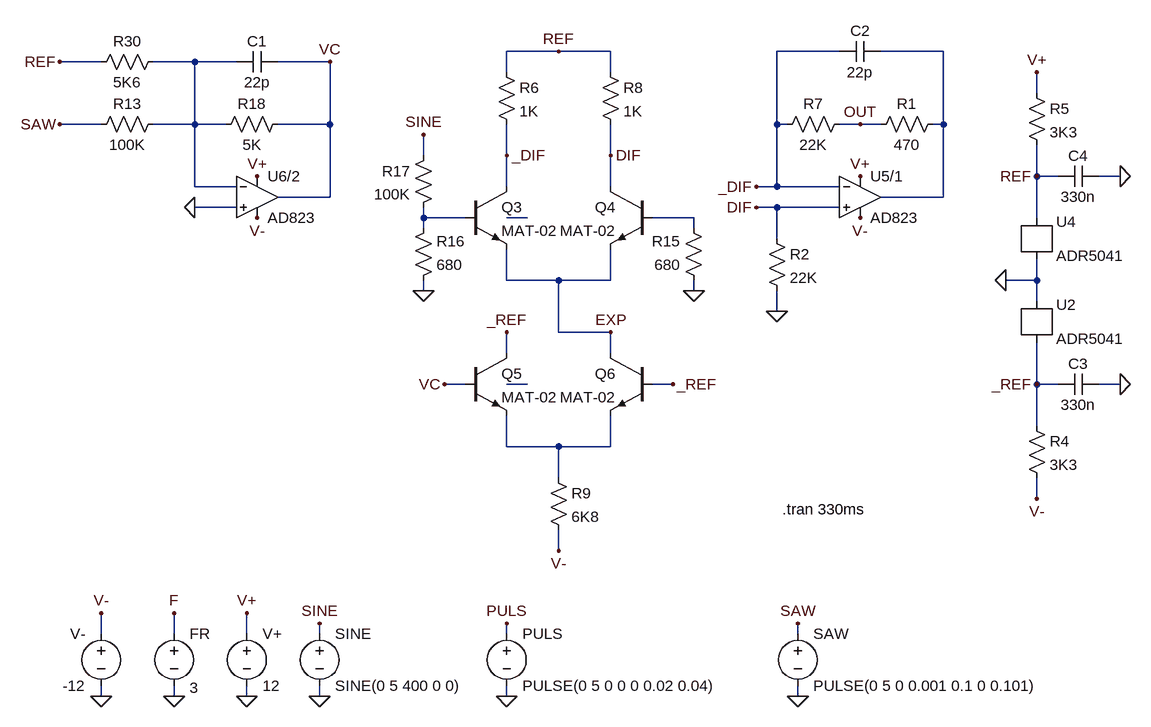
[diagram p0: schematic VCA.asc]
VCA.asc, the LTspice schematic file:
Version 4
SHEET 1 3068 3424
WIRE 1488 -240 1408 -240
WIRE 1568 -240 1488 -240
WIRE 1920 -240 1824 -240
WIRE 2080 -240 1984 -240
WIRE 784 -224 720 -224
WIRE 928 -224 864 -224
WIRE 992 -224 928 -224
WIRE 1136 -224 1056 -224
WIRE 1408 -208 1408 -240
WIRE 1568 -208 1568 -240
WIRE 2224 -176 2224 -208
WIRE 784 -128 720 -128
WIRE 928 -128 928 -224
WIRE 928 -128 864 -128
WIRE 976 -128 928 -128
WIRE 1136 -128 1136 -224
WIRE 1136 -128 1056 -128
WIRE 1824 -128 1824 -240
WIRE 1840 -128 1824 -128
WIRE 1952 -128 1920 -128
WIRE 1984 -128 1952 -128
WIRE 2080 -128 2080 -240
WIRE 2080 -128 2064 -128
WIRE 1280 -80 1280 -112
WIRE 1408 -80 1408 -128
WIRE 1568 -80 1568 -128
WIRE 2224 -48 2224 -96
WIRE 2256 -48 2224 -48
WIRE 2352 -48 2320 -48
WIRE 928 -32 928 -128
WIRE 992 -32 928 -32
WIRE 1408 -32 1408 -80
WIRE 1568 -32 1568 -80
WIRE 1824 -32 1824 -128
WIRE 1824 -32 1792 -32
WIRE 1920 -32 1824 -32
WIRE 1136 -16 1136 -128
WIRE 1136 -16 1056 -16
WIRE 2080 -16 2080 -128
WIRE 2080 -16 1984 -16
WIRE 992 0 928 0
WIRE 1824 0 1792 0
WIRE 1920 0 1824 0
WIRE 1280 16 1280 0
WIRE 1344 16 1280 16
WIRE 1440 16 1408 16
WIRE 1696 16 1632 16
WIRE 2224 16 2224 -48
WIRE 1280 32 1280 16
WIRE 1696 32 1696 16
WIRE 1824 48 1824 0
WIRE 1408 112 1408 64
WIRE 1488 112 1408 112
WIRE 1568 112 1568 64
WIRE 1568 112 1488 112
WIRE 2224 112 2224 80
WIRE 2224 112 2176 112
WIRE 1280 128 1280 112
WIRE 1696 128 1696 112
WIRE 2224 144 2224 112
WIRE 1824 160 1824 128
WIRE 1488 192 1488 112
WIRE 1568 192 1488 192
WIRE 1408 224 1408 192
WIRE 1568 224 1568 192
WIRE 1344 272 1312 272
WIRE 1440 272 1408 272
WIRE 1664 272 1632 272
WIRE 2224 272 2224 208
WIRE 2256 272 2224 272
WIRE 2352 272 2320 272
WIRE 2224 336 2224 272
WIRE 1408 368 1408 320
WIRE 1488 368 1408 368
WIRE 1568 368 1568 320
WIRE 1568 368 1488 368
WIRE 1488 416 1488 368
WIRE 2224 448 2224 416
WIRE 1488 528 1488 496
WIRE 784 656 784 624
WIRE 896 656 896 624
WIRE 1008 656 1008 624
WIRE 1120 656 1120 640
WIRE 1408 656 1408 640
WIRE 1856 656 1856 640
WIRE 784 752 784 736
WIRE 896 752 896 736
WIRE 1008 752 1008 736
WIRE 1120 752 1120 736
WIRE 1408 752 1408 736
WIRE 1856 752 1856 736
FLAG 1008 624 V+
FLAG 784 624 V-
FLAG 1952 -48 V+
FLAG 1952 16 V-
FLAG 1856 640 SAW
FLAG 1952 -128 OUT
FLAG 896 624 F
FLAG 896 752 0
FLAG 1856 752 0
FLAG 1008 752 0
FLAG 784 752 0
FLAG 1024 -48 V+
FLAG 1024 16 V-
FLAG 720 -224 REF
FLAG 1408 752 0
FLAG 1408 640 PULS
FLAG 1120 752 0
FLAG 1120 640 SINE
FLAG 1408 -80 _DIF
FLAG 1792 0 DIF
FLAG 1792 -32 _DIF
FLAG 1568 -80 DIF
FLAG 2176 112 0
FLAG 2224 -208 V+
FLAG 2224 448 V-
FLAG 2224 272 _REF
FLAG 2224 -48 REF
FLAG 1488 -240 REF
FLAG 1696 128 0
FLAG 1280 128 0
FLAG 1280 -112 SINE
FLAG 2352 272 0
FLAG 2352 -48 0
FLAG 1408 192 _REF
FLAG 1568 192 EXP
FLAG 1664 272 _REF
FLAG 1312 272 VC
FLAG 1136 -224 VC
FLAG 1488 528 V-
FLAG 720 -128 SAW
FLAG 1824 160 0
FLAG 928 0 0
SYMBOL voltage 1008 640 R0
SYMATTR InstName V+
SYMATTR Value 12
SYMBOL voltage 1856 640 R0
SYMATTR InstName SAW
SYMATTR Value PULSE(0 5 0 0.001 0.1 0 0.101)
SYMBOL voltage 784 640 M0
SYMATTR InstName V-
SYMATTR Value -12
SYMBOL OpAmps/AD823 1952 -80 R0
SYMATTR InstName U5/1
SYMBOL voltage 896 640 R0
WINDOW 3 24 99 Left 2
SYMATTR Value 3
SYMATTR InstName FR
SYMBOL OpAmps/AD823 1024 -80 R0
SYMATTR InstName U6/2
SYMBOL Res 1072 -144 R90
WINDOW 0 0 56 VBottom 2
WINDOW 3 32 56 VTop 2
SYMATTR InstName R18
SYMATTR Value 5K
SYMBOL Cap 1056 -240 R90
WINDOW 0 0 32 VBottom 2
WINDOW 3 32 32 VTop 2
SYMATTR InstName C1
SYMATTR Value 22p
SYMBOL Res 880 -240 R90
WINDOW 0 0 56 VBottom 2
WINDOW 3 32 56 VTop 2
SYMATTR InstName R30
SYMATTR Value 5K6
SYMBOL voltage 1408 640 R0
SYMATTR InstName PULS
SYMATTR Value PULSE(0 5 0 0 0 0.02 0.04)
SYMBOL voltage 1120 640 R0
SYMATTR InstName SINE
SYMATTR Value SINE(0 5 400 0 0)
SYMBOL npn 1344 -32 R0
SYMATTR InstName Q3
SYMATTR Value MAT-02
SYMBOL npn 1632 -32 M0
SYMATTR InstName Q4
SYMATTR Value MAT-02
SYMBOL References/ADR5041 2224 48 R0
SYMATTR InstName U4
SYMBOL Res 1936 -144 R90
WINDOW 0 0 56 VBottom 2
WINDOW 3 32 56 VTop 2
SYMATTR InstName R7
SYMATTR Value 22K
SYMBOL References/ADR5041 2224 176 R0
SYMATTR InstName U2
SYMBOL Res 2208 320 R0
SYMATTR InstName R4
SYMATTR Value 3K3
SYMBOL Res 2208 -192 R0
SYMATTR InstName R5
SYMATTR Value 3K3
SYMBOL Res 1392 -224 R0
SYMATTR InstName R6
SYMATTR Value 1K
SYMBOL Res 1552 -224 R0
SYMATTR InstName R8
SYMATTR Value 1K
SYMBOL Res 1712 128 R180
WINDOW 0 36 76 Left 2
WINDOW 3 36 40 Left 2
SYMATTR InstName R15
SYMATTR Value 680
SYMBOL Res 1264 128 M180
WINDOW 0 36 76 Left 2
WINDOW 3 36 40 Left 2
SYMATTR InstName R16
SYMATTR Value 680
SYMBOL Res 1296 -96 M0
SYMATTR InstName R17
SYMATTR Value 100K
SYMBOL Cap 1984 -256 R90
WINDOW 0 0 32 VBottom 2
WINDOW 3 32 32 VTop 2
SYMATTR InstName C2
SYMATTR Value 22p
SYMBOL Cap 2320 256 R90
WINDOW 0 0 32 VBottom 2
WINDOW 3 32 32 VTop 2
SYMATTR InstName C3
SYMATTR Value 330n
SYMBOL Cap 2320 -64 R90
WINDOW 0 0 32 VBottom 2
WINDOW 3 32 32 VTop 2
SYMATTR InstName C4
SYMATTR Value 330n
SYMBOL Res 2080 -144 R90
WINDOW 0 0 56 VBottom 2
WINDOW 3 32 56 VTop 2
SYMATTR InstName R1
SYMATTR Value 470
SYMBOL npn 1344 224 R0
SYMATTR InstName Q5
SYMATTR Value MAT-02
SYMBOL npn 1632 224 M0
SYMATTR InstName Q6
SYMATTR Value MAT-02
SYMBOL Res 1472 400 R0
SYMATTR InstName R9
SYMATTR Value 6K8
SYMBOL Res 880 -144 R90
WINDOW 0 0 56 VBottom 2
WINDOW 3 32 56 VTop 2
SYMATTR InstName R13
SYMATTR Value 100K
SYMBOL Res 1808 32 R0
SYMATTR InstName R2
SYMATTR Value 22K
TEXT 1832 464 Left 2 !.tran 330ms

The netlist it stands for:
* VCA.asc
V+ V+ 0 12
V§SAW SAW 0 PULSE(0 5 0 0.001 0.1 0 0.101)
V- V- 0 -12
XU5/1 DIF _DIF V+ V- N001 AD823  ; pins In+ In- V+ V- OUT
V§FR F 0 3
XU6/2 0 N002 V+ V- VC AD823  ; pins In+ In- V+ V- OUT
R18 VC N002 5K
C1 VC N002 22p
R30 N002 REF 5K6
V§PULS PULS 0 PULSE(0 5 0 0 0 0.02 0.04)
V§SINE SINE 0 SINE(0 5 400 0 0)
Q3 _DIF N003 EXP 0 MAT-02
Q4 DIF N005 EXP 0 MAT-02
XU4 REF 0 ADR5041
R7 OUT _DIF 22K
XU2 0 _REF ADR5041
R4 _REF V- 3K3
R5 V+ REF 3K3
R6 REF _DIF 1K
R8 REF DIF 1K
R15 0 N005 680
R16 0 N003 680
R17 SINE N003 100K
C2 N001 _DIF 22p
C3 0 _REF 330n
C4 0 REF 330n
R1 N001 OUT 470
Q5 _REF VC N007 0 MAT-02
Q6 EXP _REF N007 0 MAT-02
R9 N007 V- 6K8
R13 N002 SAW 100K
R2 DIF 0 22K
.model NPN NPN
.model PNP PNP
.lib standard.bjt
.tran 330ms
.lib ADI.lib
.lib ADR5041.sub
.backanno
.end